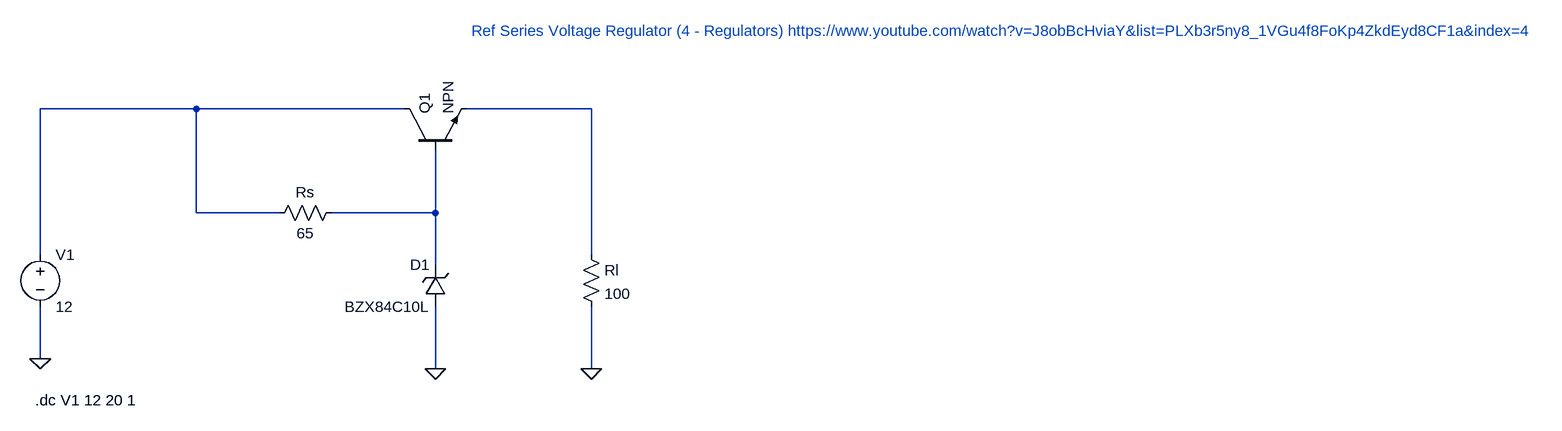
[diagram p0: schematic basic_series_voltage_regulator.asc]
basic_series_voltage_regulator.asc, the LTspice schematic file:
Version 4
SHEET 1 1804 680
WIRE -416 160 -656 160
WIRE -96 160 -416 160
WIRE 192 160 0 160
WIRE -416 320 -416 160
WIRE -288 320 -416 320
WIRE -48 320 -48 224
WIRE -48 320 -208 320
WIRE -656 384 -656 160
WIRE 192 384 192 160
WIRE -48 400 -48 320
WIRE -656 544 -656 464
WIRE -48 560 -48 464
WIRE 192 560 192 464
FLAG -48 560 0
FLAG 192 560 0
FLAG -656 544 0
SYMBOL res -192 304 R90
WINDOW 0 0 56 VBottom 2
WINDOW 3 32 56 VTop 2
SYMATTR InstName Rs
SYMATTR Value 65
SYMBOL res 176 368 R0
SYMATTR InstName Rl
SYMATTR Value 100
SYMBOL npn -96 224 R270
SYMATTR InstName Q1
SYMBOL zener -32 464 R180
WINDOW 0 24 64 Left 2
WINDOW 3 24 0 Left 2
SYMATTR InstName D1
SYMATTR Value BZX84C10L
SYMBOL voltage -656 368 R0
WINDOW 123 0 0 Left 0
WINDOW 39 0 0 Left 0
SYMATTR InstName V1
SYMATTR Value 12
TEXT 8 40 Left 2 ;Ref Series Voltage Regulator (4 - Regulators) https://www.youtube.com/watch?v=J8obBcHviaY&list=PLXb3r5ny8_1VGu4f8FoKp4ZkdEyd8CF1a&index=4
TEXT -664 608 Left 2 !.dc V1 12 20 1

The netlist it stands for:
* basic_series_voltage_regulator.asc
Rs N003 N001 65
Rl N002 0 100
Q1 N001 N003 N002 0 NPN
D1 0 N003 BZX84C10L
V1 N001 0 12
.model D D
.lib standard.dio
.model NPN NPN
.model PNP PNP
.lib standard.bjt
* Ref Series Voltage Regulator (4 - Regulators) https://www.youtube.com/watch?v=J8obBcHviaY&list=PLXb3r5ny8_1VGu4f8FoKp4ZkdEyd8CF1a&index=4
.dc V1 12 20 1
.backanno
.end